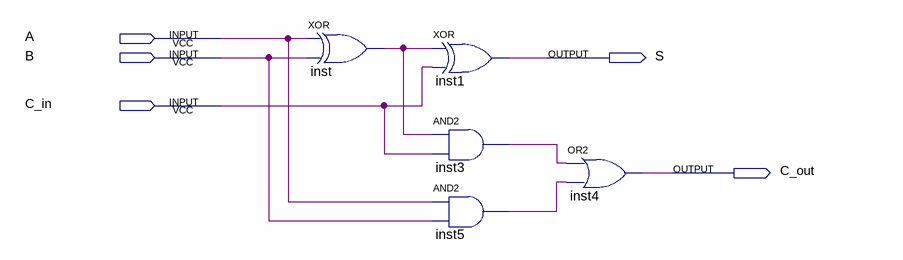
[diagram p0: schematic sheet]
// Quartus schematic full_adder.bdf as structural Verilog: 5 symbols, 5 pins
module full_adder (
  input  A,
  input  B,
  input  C_in,
  output S,
  output C_out
);

  wire inst3_out, inst5_out, inst_out;

  xor inst (inst_out, A, B);
  xor inst1 (S, inst_out, C_in);
  and inst3 (inst3_out, inst_out, C_in);
  and inst5 (inst5_out, A, B);
  or inst4 (C_out, inst3_out, inst5_out);
endmodule
